# Altium schematic sheet 03_Inputs_10-18.SchDoc
size 594 x 420 mm; DocumentNumber: Входы сухой контакт; SheetNumber: 3; SheetTotal: 6
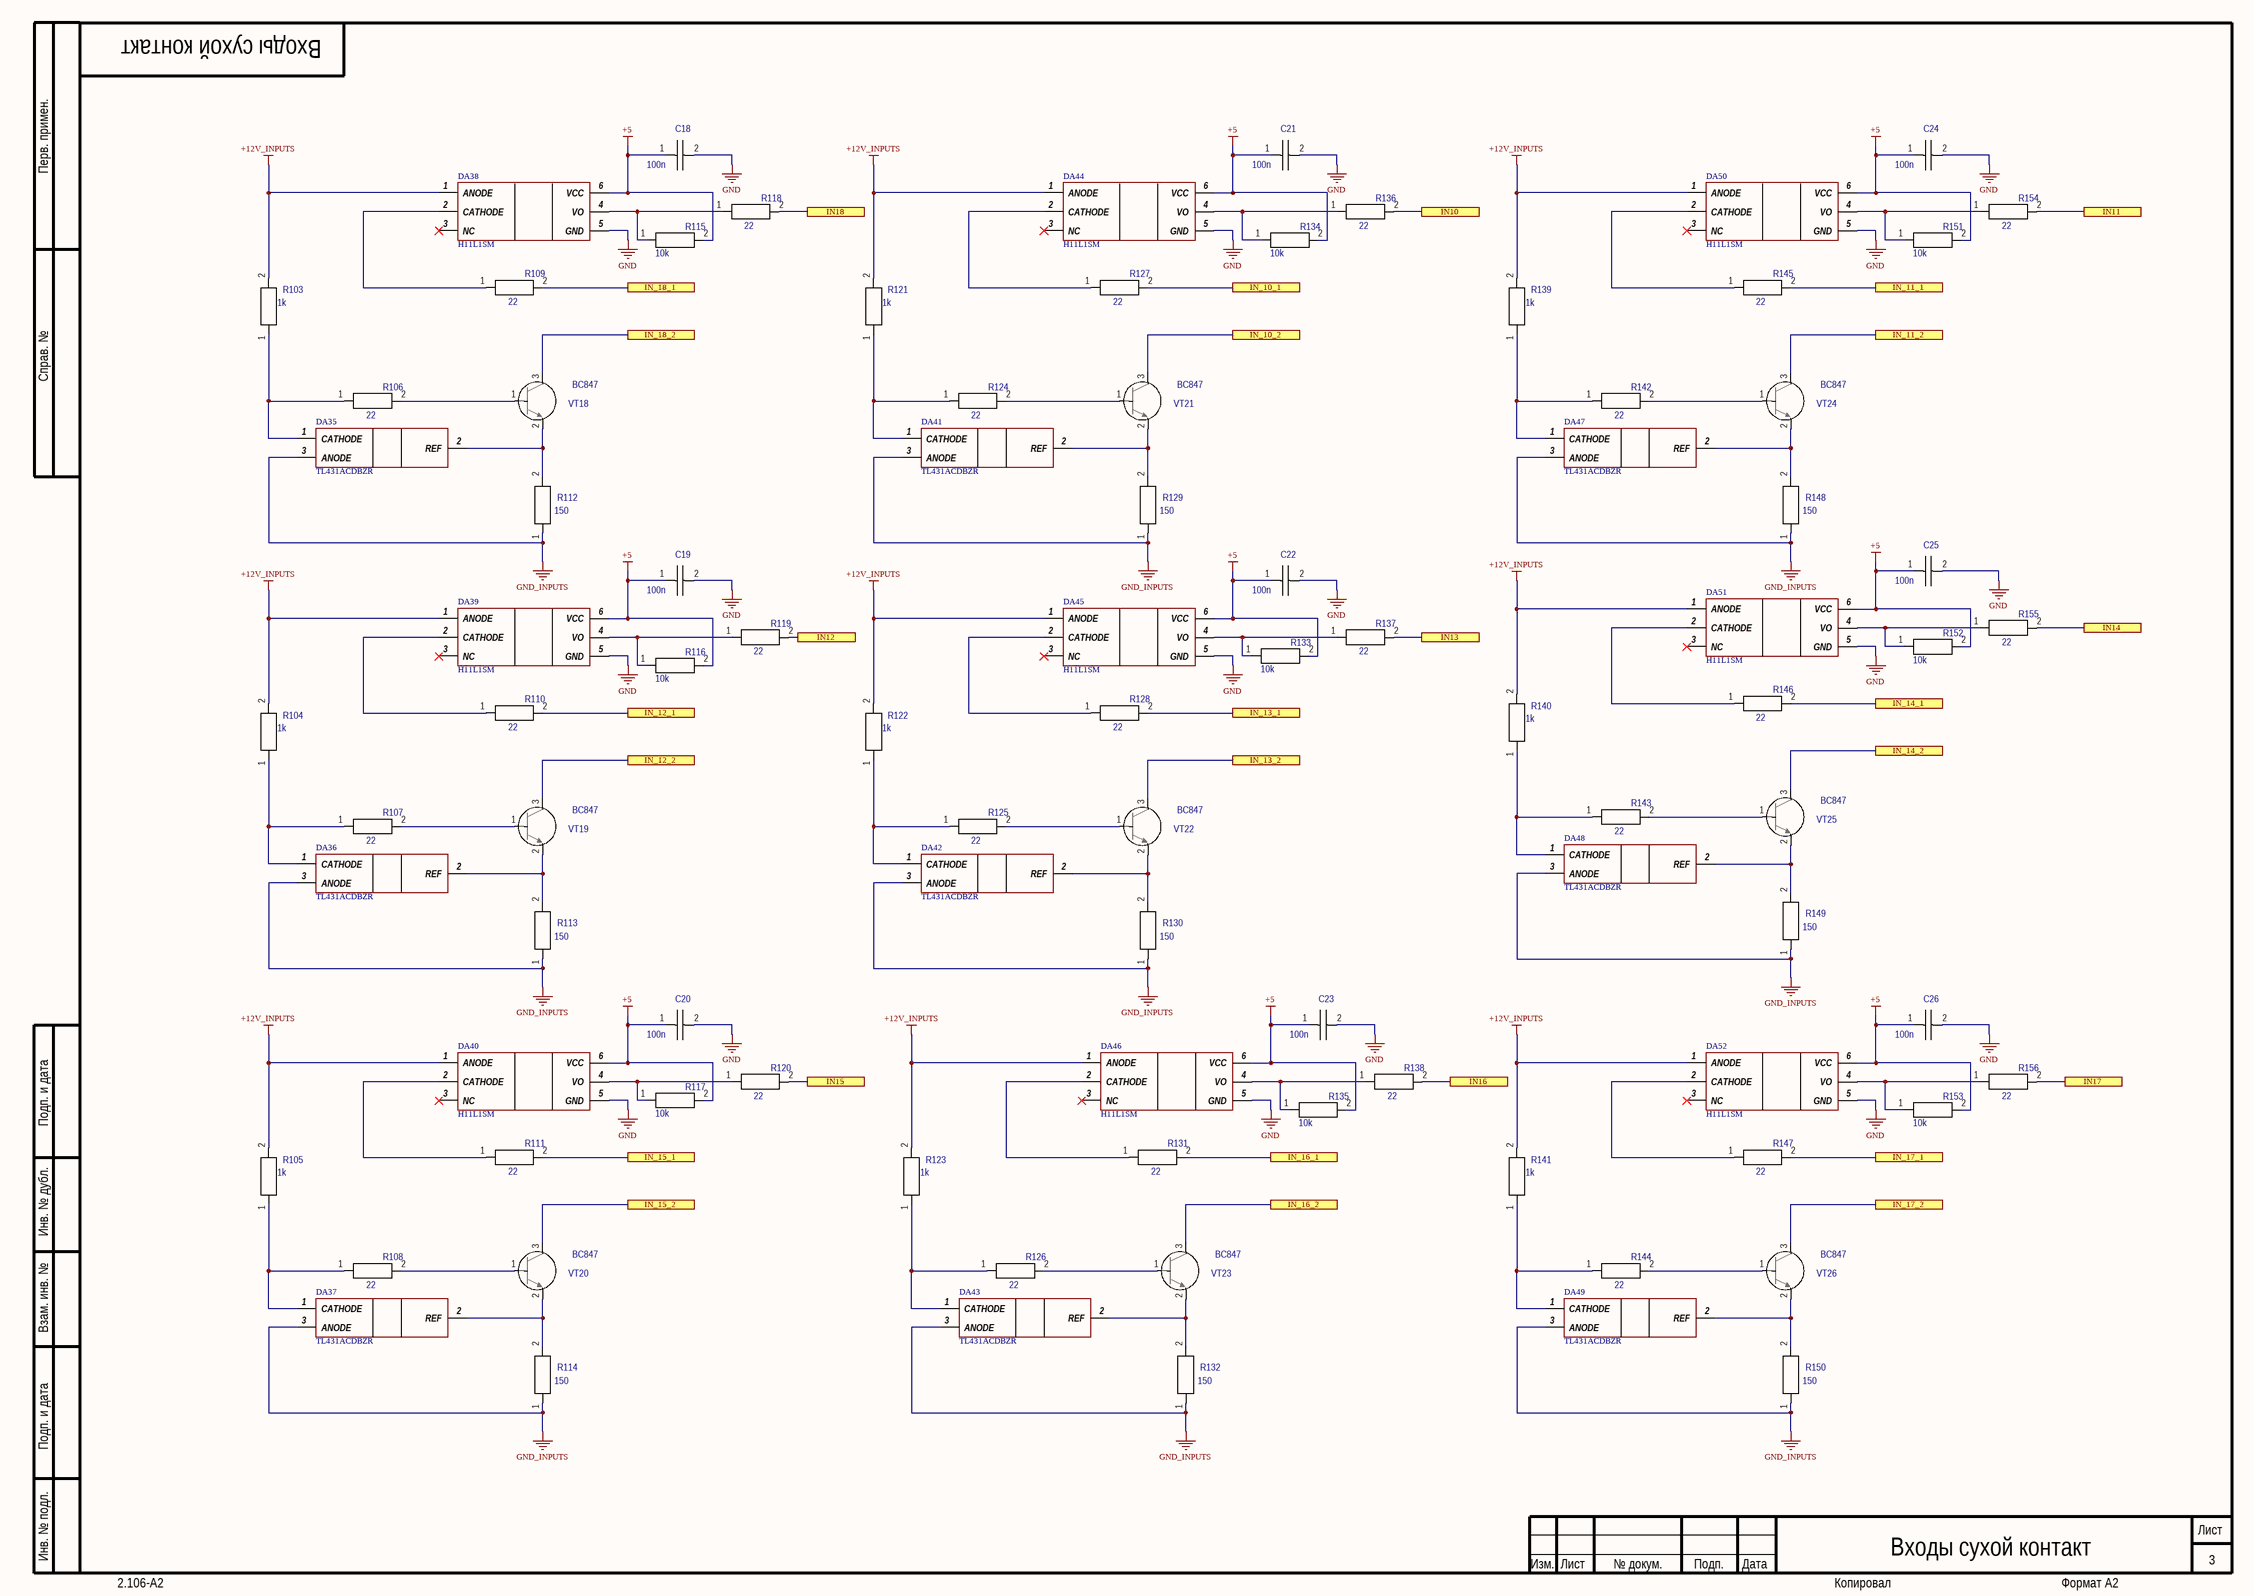
[diagram p0: 03_Inputs_10-18.SchDoc]

## Parts
C18  value 100n  [C0603]  (hidden comment: C0603)
C19  value 100n  [C0603]  (hidden comment: C0603)
C20  value 100n  [C0603]  (hidden comment: C0603)
C21  value 100n  [C0603]  (hidden comment: C0603)
C22  value 100n  [C0603]  (hidden comment: C0603)
C23  value 100n  [C0603]  (hidden comment: C0603)
C24  value 100n  [C0603]  (hidden comment: C0603)
C25  value 100n  [C0603]  (hidden comment: C0603)
C26  value 100n  [C0603]  (hidden comment: C0603)
DA35  TL431ACDBZR  [SOT95P237X112-3N]
DA36  TL431ACDBZR  [SOT95P237X112-3N]
DA37  TL431ACDBZR  [SOT95P237X112-3N]
DA38  H11L1SM  [SOP254P1030X460-6N]
DA39  H11L1SM  [SOP254P1030X460-6N]
DA40  H11L1SM  [SOP254P1030X460-6N]
DA41  TL431ACDBZR  [SOT95P237X112-3N]
DA42  TL431ACDBZR  [SOT95P237X112-3N]
DA43  TL431ACDBZR  [SOT95P237X112-3N]
DA44  H11L1SM  [SOP254P1030X460-6N]
DA45  H11L1SM  [SOP254P1030X460-6N]
DA46  H11L1SM  [SOP254P1030X460-6N]
DA47  TL431ACDBZR  [SOT95P237X112-3N]
DA48  TL431ACDBZR  [SOT95P237X112-3N]
DA49  TL431ACDBZR  [SOT95P237X112-3N]
DA50  H11L1SM  [SOP254P1030X460-6N]
DA51  H11L1SM  [SOP254P1030X460-6N]
DA52  H11L1SM  [SOP254P1030X460-6N]
R103  value 1k  [RESC1608N]  (hidden comment: R0603)
R104  value 1k  [RESC1608N]  (hidden comment: R0603)
R105  value 1k  [RESC1608N]  (hidden comment: R0603)
R106  value 22  [RESC1608N]  (hidden comment: R0603)
R107  value 22  [RESC1608N]  (hidden comment: R0603)
R108  value 22  [RESC1608N]  (hidden comment: R0603)
R109  value 22  [RESC1608N]  (hidden comment: R0603)
R110  value 22  [RESC1608N]  (hidden comment: R0603)
R111  value 22  [RESC1608N]  (hidden comment: R0603)
R112  value 150  [RESC1608N]  (hidden comment: R0603)
R113  value 150  [RESC1608N]  (hidden comment: R0603)
R114  value 150  [RESC1608N]  (hidden comment: R0603)
R115  value 10k  [RESC1608N]  (hidden comment: R0603)
R116  value 10k  [RESC1608N]  (hidden comment: R0603)
R117  value 10k  [RESC1608N]  (hidden comment: R0603)
R118  value 22  [RESC1608N]  (hidden comment: R0603)
R119  value 22  [RESC1608N]  (hidden comment: R0603)
R120  value 22  [RESC1608N]  (hidden comment: R0603)
R121  value 1k  [RESC1608N]  (hidden comment: R0603)
R122  value 1k  [RESC1608N]  (hidden comment: R0603)
R123  value 1k  [RESC1608N]  (hidden comment: R0603)
R124  value 22  [RESC1608N]  (hidden comment: R0603)
R125  value 22  [RESC1608N]  (hidden comment: R0603)
R126  value 22  [RESC1608N]  (hidden comment: R0603)
R127  value 22  [RESC1608N]  (hidden comment: R0603)
R128  value 22  [RESC1608N]  (hidden comment: R0603)
R129  value 150  [RESC1608N]  (hidden comment: R0603)
R130  value 150  [RESC1608N]  (hidden comment: R0603)
R131  value 22  [RESC1608N]  (hidden comment: R0603)
R132  value 150  [RESC1608N]  (hidden comment: R0603)
R133  value 10k  [RESC1608N]  (hidden comment: R0603)
R134  value 10k  [RESC1608N]  (hidden comment: R0603)
R135  value 10k  [RESC1608N]  (hidden comment: R0603)
R136  value 22  [RESC1608N]  (hidden comment: R0603)
R137  value 22  [RESC1608N]  (hidden comment: R0603)
R138  value 22  [RESC1608N]  (hidden comment: R0603)
R139  value 1k  [RESC1608N]  (hidden comment: R0603)
R140  value 1k  [RESC1608N]  (hidden comment: R0603)
R141  value 1k  [RESC1608N]  (hidden comment: R0603)
R142  value 22  [RESC1608N]  (hidden comment: R0603)
R143  value 22  [RESC1608N]  (hidden comment: R0603)
R144  value 22  [RESC1608N]  (hidden comment: R0603)
R145  value 22  [RESC1608N]  (hidden comment: R0603)
R146  value 22  [RESC1608N]  (hidden comment: R0603)
R147  value 22  [RESC1608N]  (hidden comment: R0603)
R148  value 150  [RESC1608N]  (hidden comment: R0603)
R149  value 150  [RESC1608N]  (hidden comment: R0603)
R150  value 150  [RESC1608N]  (hidden comment: R0603)
R151  value 10k  [RESC1608N]  (hidden comment: R0603)
R152  value 10k  [RESC1608N]  (hidden comment: R0603)
R153  value 10k  [RESC1608N]  (hidden comment: R0603)
R154  value 22  [RESC1608N]  (hidden comment: R0603)
R155  value 22  [RESC1608N]  (hidden comment: R0603)
R156  value 22  [RESC1608N]  (hidden comment: R0603)
VT18  BC847  [SOT23-3N]
VT19  BC847  [SOT23-3N]
VT20  BC847  [SOT23-3N]
VT21  BC847  [SOT23-3N]
VT22  BC847  [SOT23-3N]
VT23  BC847  [SOT23-3N]
VT24  BC847  [SOT23-3N]
VT25  BC847  [SOT23-3N]
VT26  BC847  [SOT23-3N]

## Ports
IN10, IN11, IN12, IN13, IN14, IN15, IN16, IN17, IN18, IN_10_1, IN_10_2, IN_11_1, IN_11_2, IN_12_1, IN_12_2, IN_13_1, IN_13_2, IN_14_1, IN_14_2, IN_15_1, IN_15_2, IN_16_1, IN_16_2, IN_17_1, IN_17_2, IN_18_1, IN_18_2

## Nets
+5: C18.1 C19.1 C20.1 C21.1 C22.1 C23.1 C24.1 C25.1 C26.1 DA38.6(VCC) DA39.6(VCC) DA40.6(VCC) DA44.6(VCC) DA45.6(VCC) DA46.6(VCC) DA50.6(VCC) DA51.6(VCC) DA52.6(VCC) R115.2 R116.2 R117.2 R133.2 R134.2 R135.2 R151.2 R152.2 R153.2
+12V_INPUTS: DA38.1(ANODE) DA39.1(ANODE) DA40.1(ANODE) DA44.1(ANODE) DA45.1(ANODE) DA46.1(ANODE) DA50.1(ANODE) DA51.1(ANODE) DA52.1(ANODE) R103.2 R104.2 R105.2 R121.2 R122.2 R123.2 R139.2 R140.2 R141.2
GND: C18.2 C19.2 C20.2 C21.2 C22.2 C23.2 C24.2 C25.2 C26.2 DA38.5(GND) DA39.5(GND) DA40.5(GND) DA44.5(GND) DA45.5(GND) DA46.5(GND) DA50.5(GND) DA51.5(GND) DA52.5(GND)
GND_INPUTS: DA35.3(ANODE) DA36.3(ANODE) DA37.3(ANODE) DA41.3(ANODE) DA42.3(ANODE) DA43.3(ANODE) DA47.3(ANODE) DA48.3(ANODE) DA49.3(ANODE) R112.1 R113.1 R114.1 R129.1 R130.1 R132.1 R148.1 R149.1 R150.1
IN10: R136.2 ; port IN10
IN11: R154.2 ; port IN11
IN12: R119.2 ; port IN12
IN13: R137.2 ; port IN13
IN14: R155.2 ; port IN14
IN15: R120.2 ; port IN15
IN16: R138.2 ; port IN16
IN17: R156.2 ; port IN17
IN18: R118.2 ; port IN18
IN_10_1: R127.2 ; port IN_10_1
IN_10_2: VT21.3 ; port IN_10_2
IN_11_1: R145.2 ; port IN_11_1
IN_11_2: VT24.3 ; port IN_11_2
IN_12_1: R110.2 ; port IN_12_1
IN_12_2: VT19.3 ; port IN_12_2
IN_13_1: R128.2 ; port IN_13_1
IN_13_2: VT22.3 ; port IN_13_2
IN_14_1: R146.2 ; port IN_14_1
IN_14_2: VT25.3 ; port IN_14_2
IN_15_1: R111.2 ; port IN_15_1
IN_15_2: VT20.3 ; port IN_15_2
IN_16_1: R131.2 ; port IN_16_1
IN_16_2: VT23.3 ; port IN_16_2
IN_17_1: R147.2 ; port IN_17_1
IN_17_2: VT26.3 ; port IN_17_2
IN_18_1: R109.2 ; port IN_18_1
IN_18_2: VT18.3 ; port IN_18_2
NetDA35_1: DA35.1(CATHODE) R103.1 R106.1
NetDA35_2: DA35.2(REF) R112.2 VT18.2
NetDA36_1: DA36.1(CATHODE) R104.1 R107.1
NetDA36_2: DA36.2(REF) R113.2 VT19.2
NetDA37_1: DA37.1(CATHODE) R105.1 R108.1
NetDA37_2: DA37.2(REF) R114.2 VT20.2
NetDA38_2: DA38.2(CATHODE) R109.1
NetDA38_4: DA38.4(VO) R115.1 R118.1
NetDA39_2: DA39.2(CATHODE) R110.1
NetDA39_4: DA39.4(VO) R116.1 R119.1
NetDA40_2: DA40.2(CATHODE) R111.1
NetDA40_4: DA40.4(VO) R117.1 R120.1
NetDA41_1: DA41.1(CATHODE) R121.1 R124.1
NetDA41_2: DA41.2(REF) R129.2 VT21.2
NetDA42_1: DA42.1(CATHODE) R122.1 R125.1
NetDA42_2: DA42.2(REF) R130.2 VT22.2
NetDA43_1: DA43.1(CATHODE) R123.1 R126.1
NetDA43_2: DA43.2(REF) R132.2 VT23.2
NetDA44_2: DA44.2(CATHODE) R127.1
NetDA44_4: DA44.4(VO) R134.1 R136.1
NetDA45_2: DA45.2(CATHODE) R128.1
NetDA45_4: DA45.4(VO) R133.1 R137.1
NetDA46_2: DA46.2(CATHODE) R131.1
NetDA46_4: DA46.4(VO) R135.1 R138.1
NetDA47_1: DA47.1(CATHODE) R139.1 R142.1
NetDA47_2: DA47.2(REF) R148.2 VT24.2
NetDA48_1: DA48.1(CATHODE) R140.1 R143.1
NetDA48_2: DA48.2(REF) R149.2 VT25.2
NetDA49_1: DA49.1(CATHODE) R141.1 R144.1
NetDA49_2: DA49.2(REF) R150.2 VT26.2
NetDA50_2: DA50.2(CATHODE) R145.1
NetDA50_4: DA50.4(VO) R151.1 R154.1
NetDA51_2: DA51.2(CATHODE) R146.1
NetDA51_4: DA51.4(VO) R152.1 R155.1
NetDA52_2: DA52.2(CATHODE) R147.1
NetDA52_4: DA52.4(VO) R153.1 R156.1
NetR106_2: R106.2 VT18.1
NetR107_2: R107.2 VT19.1
NetR108_2: R108.2 VT20.1
NetR124_2: R124.2 VT21.1
NetR125_2: R125.2 VT22.1
NetR126_2: R126.2 VT23.1
NetR142_2: R142.2 VT24.1
NetR143_2: R143.2 VT25.1
NetR144_2: R144.2 VT26.1

Not connected (* = marked no-connect by the designer): DA38 3(NC)*; DA39 3(NC)*; DA40 3(NC)*; DA44 3(NC)*; DA45 3(NC)*; DA46 3(NC)*; DA50 3(NC)*; DA51 3(NC)*; DA52 3(NC)*

## Notes on the sheet
- Перв. примен.
- Справ. №
- Подп. и дата
- Инв. № дубл.
- Взам. инв. №
- Инв. № подл.
- Изм.
- Лист
- № докум.
- Подп.
- Дата
- 2.106-A2
- Копировал
- Формат А2

## Library data of the parts
C18-C26 = GRM188R71C104KA01D: Manufacturer: Murata Manufacturing; Код: 22; ID: Конденсатор; Power/Voltage: 16V; Tolerance: ±10%; TKE: X7R; iii: Конденсатор GRM188R71C104KA01D 100n 16V ±10% C0603 X7R  Murata Manufacturing; Comments: C0603; Part Number: GRM188R71C104KA01D; Height: 0.9; Package: C0603; TemperatureMin: -55; TemperatureMax: 125
DA35-DA37 DA41-DA43 DA47-DA49 = TL431ACDBZR: Integrated Circuit; Manufacturer_Name: Texas Instruments; Datasheet Link: https://datasheet.datasheetarchive.com/originals/distributors/SFDatasheet-6/sf-000131849.pdf; Manufacturer_Part_Number: TL431ACDBZR; Mouser Part Number: 595-TL431ACDBZR; Mouser Price/Stock: https://www.mouser.co.uk/ProductDetail/Texas-Instruments/TL431ACDBZR?qs=odmYgEirbwzMcBuFx%2Fo8hQ%3D%3D; Arrow Part Number: TL431ACDBZR; Arrow Price/Stock: https://www.arrow.com/en/products/tl431acdbzr/texas-instruments?region=nac; PartNumber: TL431ACDBZR
DA38-DA40 DA44-DA46 DA50-DA52 = H11L1SM: Integrated Circuit; Manufacturer_Name: Iso Com; Datasheet Link: http://isocom.com/wp-content/uploads/2017/09/DD93224-H11L1_H11L1V-110817.pdf; Height: 4.6mm; Manufacturer_Part_Number: H11L1SM; PartNumber: H11L1SM
R103-R105 R121-R123 R139-R141 = RC0603FK-071KL: Manufacturer: Тайвань; Код: 31; ID: Резистор; Power/Voltage: 0.063W/50V; Tolerance: ±1%; iii: Резистор RC0603FK-071KL 1k 0.063W/50V ±1% R0603  Тайвань; Comments: R0603; Part Number: RC0603FK-071KL; Package: R0603; TemperatureMin: -55; TemperatureMax: 155
R106-R111 R118-R120 R124-R128 R131 R136-R138 R142-R147 R154-R156 = RC0603FK-0722RL: Manufacturer: Тайвань; Код: 11; ID: Резистор; Power/Voltage: 0.063W/50V; Tolerance: ±1%; iii: Резистор RC0603FK-0722RL 22 0.063W/50V ±1% R0603  Тайвань; Comments: R0603; Part Number: RC0603FK-0722RL; Package: R0603; TemperatureMin: -55; TemperatureMax: 155
R112-R114 R129 R130 R132 R148-R150 = RC0603FK-07150RL: Manufacturer: Тайвань; Код: 17; ID: Резистор; Power/Voltage: 0.063W/50V; Tolerance: ±1%; iii: Резистор RC0603FK-07150RL 150 0.063W/50V ±1% R0603  Тайвань; Comments: R0603; Part Number: RC0603FK-07150RL; Package: R0603; TemperatureMin: -55; TemperatureMax: 155
R115-R117 R133-R135 R151-R153 = RC0603FK-0710KL: Part Number: RC0603FR-0710KL; Manufacturer: Тайвань; Код: 26; ID: Резистор; Power/Voltage: 0.063W/50V; Tolerance: ±1%; iii: Резистор RC0603FK-0710KL 10k 0.063W/50V ±1% R0603  Тайвань; Comments: R0603; Package: R0603; TemperatureMin: -55; TemperatureMax: 155
VT18-VT26 = BC847: Manufacturer: NXP Semiconductor; Код: 2; ID: Транзистор; Value: 0.1A; Power/Voltage: 45V; iii: Транзистор BC847 0.1A 45V  sot23  NXP Semiconductor; Com: BC847; Part Number: BC847; Package: sot23